# Altium schematic sheet 04_Codec.SchDoc
size 513 x 386 mm
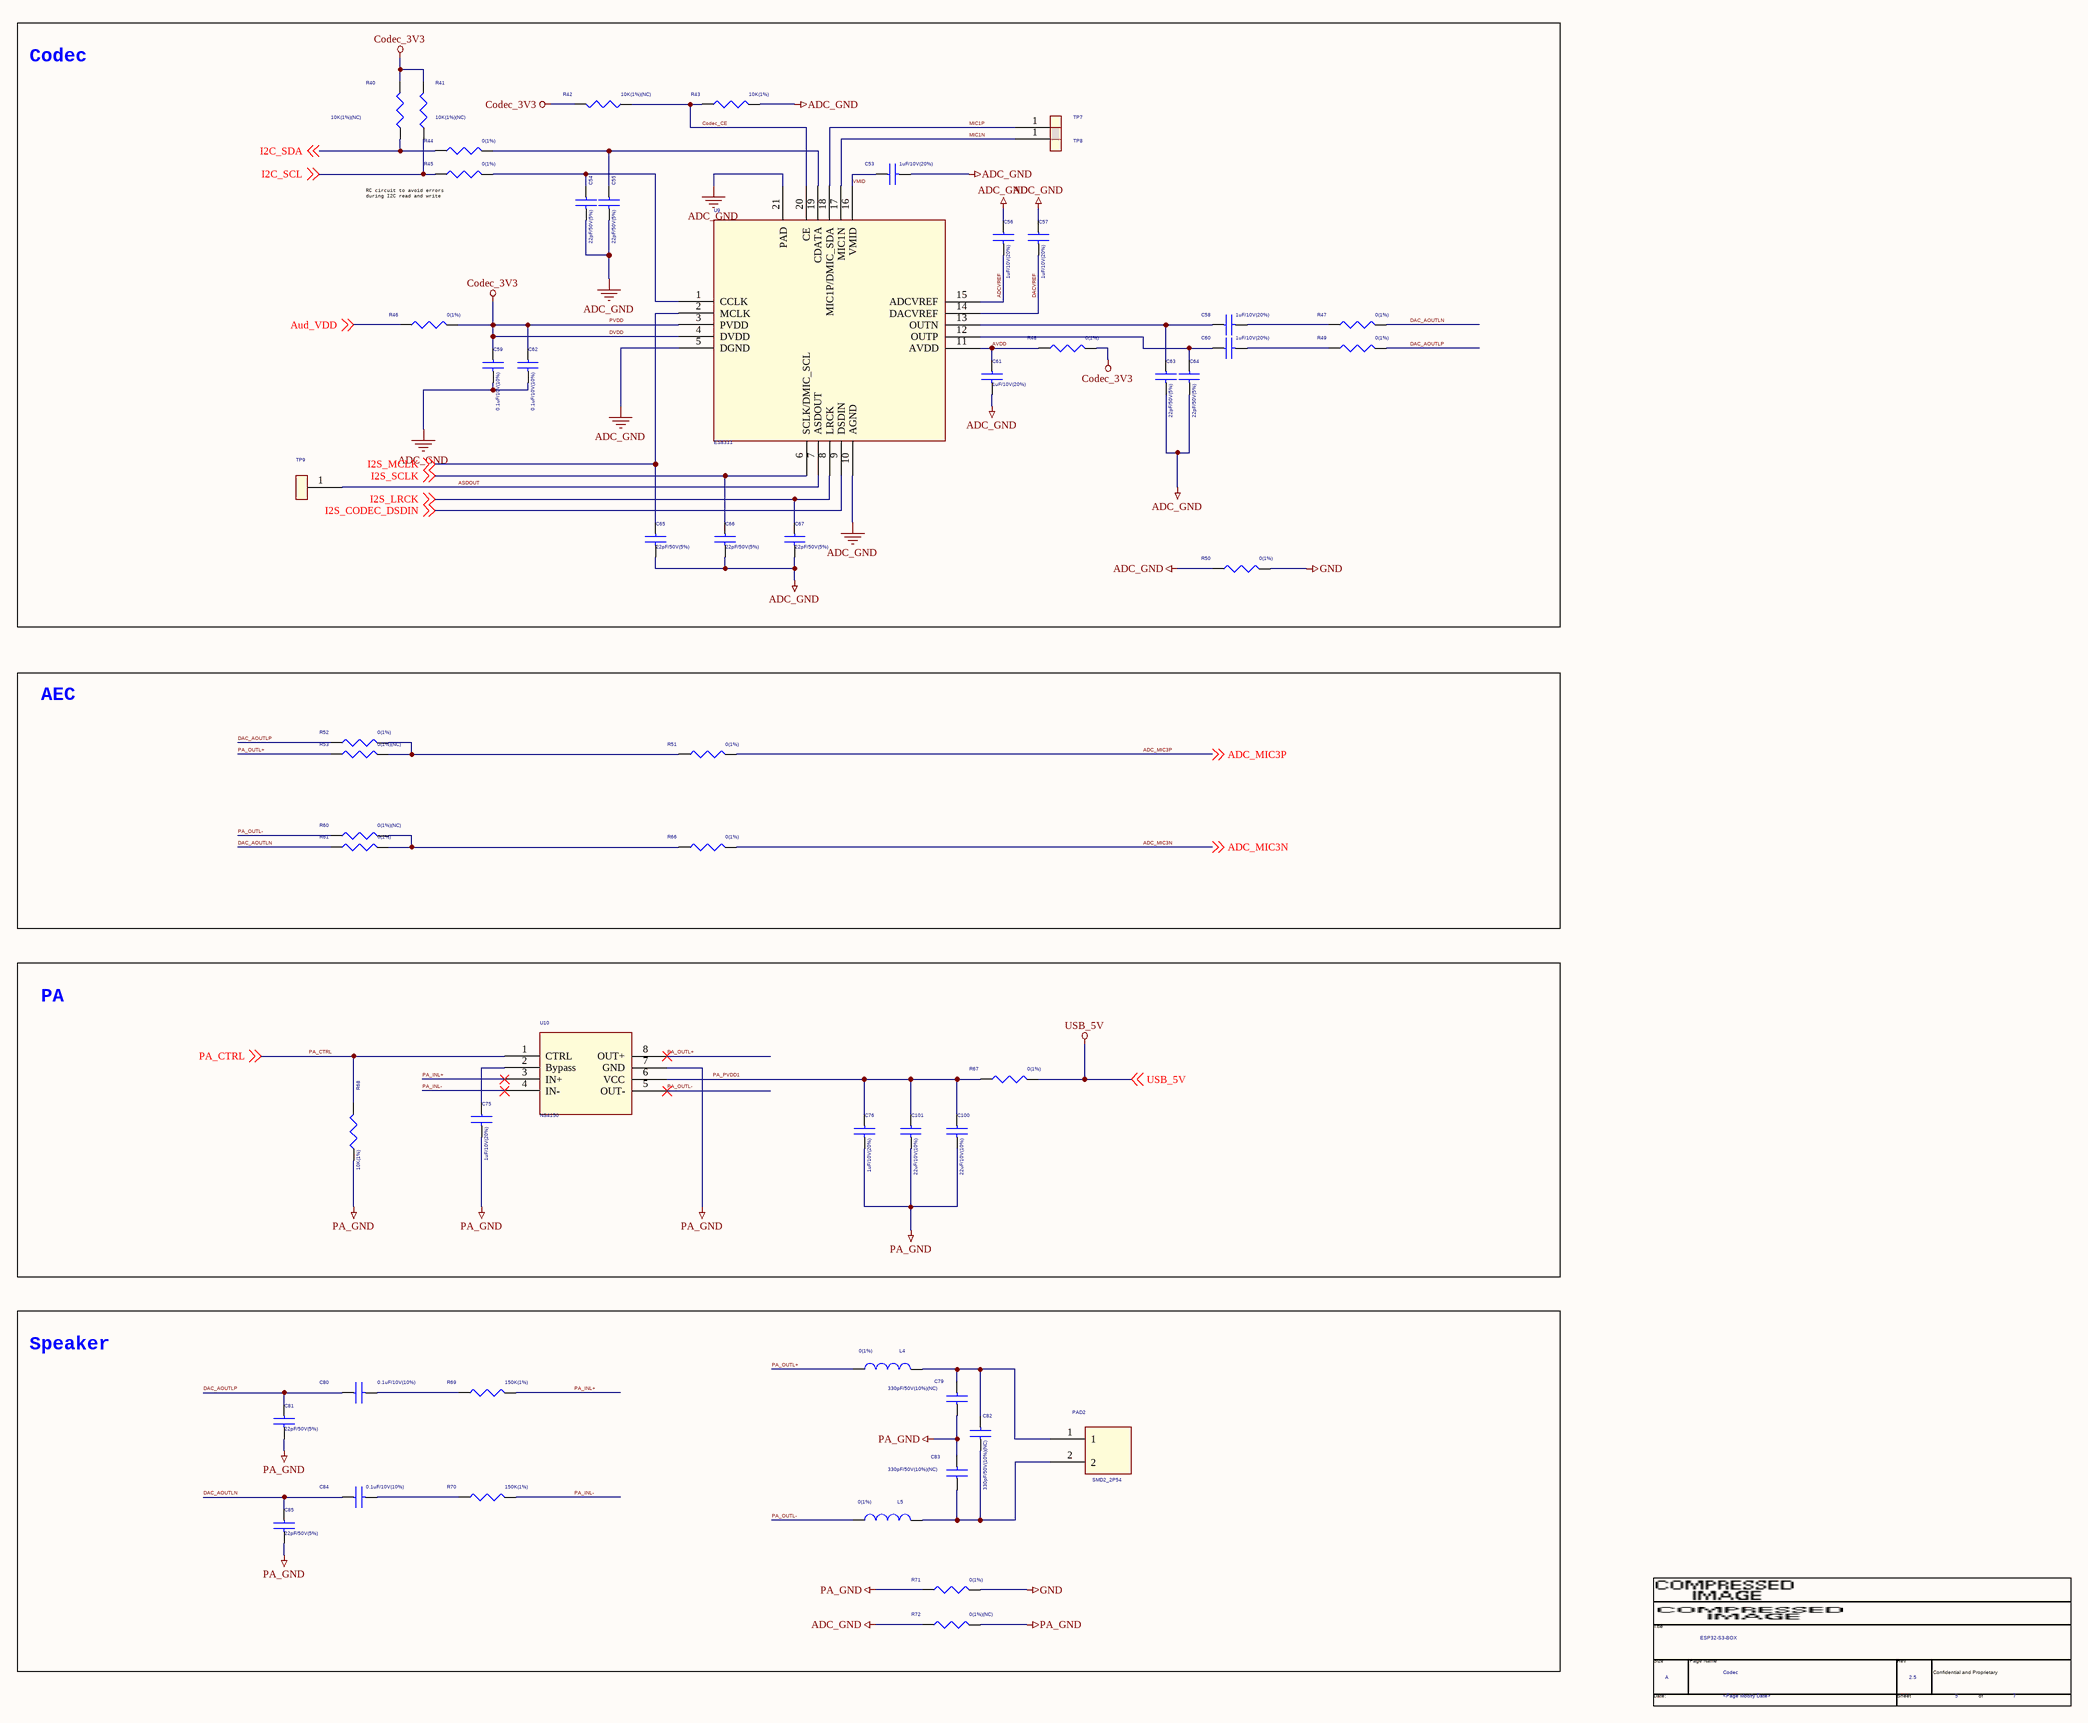
[diagram p0: 04_Codec.SchDoc]

## Parts
*  Page Modify Date: <Page Modify Date>  Page Name: Codec  Title: ESP32-S3-BOX  Page Size: A  Page Number: 5  Page Count: 7  RevCode: 2.5  (hidden comment: espTitleBlock3)  (graphical)
C53  1uF/10V(20%)  [0201_C]
C54  22pF/50V(5%)  [0201_C]
C55  22pF/50V(5%)  [0201_C]
C56  1uF/10V(20%)  [0201_C]
C57  1uF/10V(20%)  [0201_C]
C58  1uF/10V(20%)  [0201_C]
C59  0.1uF/10V(10%)  [0201_C]
C60  1uF/10V(20%)  [0201_C]
C61  1uF/10V(20%)  [0201_C]
C62  0.1uF/10V(10%)  [0201_C]
C63  22pF/50V(5%)  [0201_C]
C64  22pF/50V(5%)  [0201_C]
C65  22pF/50V(5%)  [0201_C]
C66  22pF/50V(5%)  [0201_C]
C67  22pF/50V(5%)  [0201_C]
C75  1uF/10V(20%)  [0201_C]
C76  1uF/10V(20%)  [0201_C]
C79  330pF/50V(10%)(NC)  [0201_C]
C80  0.1uF/10V(10%)  [0201_C]
C81  22pF/50V(5%)  [0201_C]
C82  330pF/50V(10%)(NC)  [0201_C]
C83  330pF/50V(10%)(NC)  [0201_C]
C84  0.1uF/10V(10%)  [0201_C]
C85  22pF/50V(5%)  [0201_C]
C100  22uF/10V(10%)  [0805_C]
C101  22uF/10V(10%)  [0805_C]
L4  0(1%)  [0603_R]
L5  0(1%)  [0603_R]
PAD2  SMD2_2P54  [2pin]
R40  10K(1%)(NC)  [0201_R]
R41  10K(1%)(NC)  [0201_R]
R42  10K(1%)(NC)  [0201_R]
R43  10K(1%)  [0201_R]
R44  0(1%)  [0201_R]
R45  0(1%)  [0201_R]
R46  0(1%)  [0402_R]
R47  0(1%)  [0201_R]
R48  0(1%)  [0402_R]
R49  0(1%)  [0201_R]
R50  0(1%)  [0402_R]
R51  0(1%)  [0201_R]
R52  0(1%)  [0201_R]
R53  0(1%)(NC)  [0201_R]
R60  0(1%)(NC)  [0201_R]
R61  0(1%)  [0201_R]
R66  0(1%)  [0201_R]
R67  0(1%)  [0402_R]
R68  10K(1%)  [0201_R]
R69  150K(1%)  [0402_R]
R70  150K(1%)  [0402_R]
R71  0(1%)  [0402_R]
R72  0(1%)(NC)  [0402_R]
TP7  TESTPOINT  [TPC_D40]  (value not drawn)
TP8  TESTPOINT  [TPC_D40]  (value not drawn)
TP9  TESTPOINT  [TPC_D40]  (value not drawn)
U9  ES8311  [QFN-20_4X4]
U10  NS4150  [MSOP-8]

## Blocks framed on the sheet
Codec: C53-C67 R40-R50 TP7-TP9 U9
AEC: R51-R53 R60 R61 R66
PA: C75 C76 C100 C101 R67 R68 U10
Speaker: C79-C85 L4 L5 PAD2 R69-R72

## Nets
ADC_GND: C53.2 C54.2 C55.2 C56.1 C57.1 C59.2 C61.2 C62.2 C63.2 C64.2 C65.2 C66.2 C67.2 R43.2 R50.1 R72.1 U9.5(DGND) U9.10(AGND) U9.21(PAD)
DVDD: C59.1 C62.1 R40.2 R41.2 R42.2 R46.2 R48.2 U9.3(PVDD) U9.4(DVDD)  [also labelled Codec_3V3, PVDD]
GND: R50.2 R71.2
PA_GND: C75.2 C76.2 C79.1 C81.2 C83.2 C85.2 C100.2 C101.2 R68.1 R71.1 R72.2 U10.7(GND)
USB_5V: R67.2 ; off-sheet USB_5V
ADC_MIC3N: R66.2 ; off-sheet ADC_MIC3N
ADC_MIC3P: R51.2 ; off-sheet ADC_MIC3P
ADCVREF: C56.2 U9.15(ADCVREF)
ASDOUT: TP9.1 U9.7(ASDOUT)
Aud_VDD: R46.1 ; off-sheet Aud_VDD
AVDD: C61.1 R48.1 U9.11(AVDD)
Codec_CE: R42.1 R43.1 U9.20(CE)
DAC_AOUTLN: C84.1 C85.1 R47.2 R61.1
DAC_AOUTLP: C80.1 C81.1 R49.2 R52.1
DACVREF: C57.2 U9.14(DACVREF)
I2C_SCL: R41.1 R45.1 ; off-sheet I2C_SCL
I2C_SDA: R40.1 R44.1 ; off-sheet I2C_SDA
I2S_CODEC_DSDIN: U9.9(DSDIN) ; off-sheet I2S_CODEC_DSDIN
I2S_LRCK: C67.1 U9.8(LRCK) ; off-sheet I2S_LRCK
I2S_MCLK: C65.1 U9.2(MCLK) ; off-sheet I2S_MCLK
I2S_SCLK: C66.1 U9.6(SCLK/DMIC_SCL) ; off-sheet I2S_SCLK
MIC1N: TP8.1 U9.17(MIC1N)
MIC1P: TP7.1 U9.18(MIC1P/DMIC_SDA)
PA_CTRL: R68.2 U10.1(CTRL) ; off-sheet PA_CTRL
PA_INL+: R69.2 U10.3(IN+)
PA_INL-: R70.2 U10.4(IN-)
PA_OUTL+: L4.2 R53.1 U10.8(OUT+)
PA_OUTL-: L5.2 R60.1 U10.5(OUT-)
PA_PVDD1: C76.1 C100.1 C101.1 R67.1 U10.6(VCC)
VMID: C53.1 U9.16(VMID)
NetC54_1: C54.1 R45.2 U9.1(CCLK)
NetC55_1: C55.1 R44.2 U9.19(CDATA)
NetC58_1: C58.1 C63.1 U9.13(OUTN)
NetC58_2: C58.2 R47.1
NetC60_1: C60.1 C64.1 U9.12(OUTP)
NetC60_2: C60.2 R49.1
NetC75_1: C75.1 U10.2(Bypass)
NetC79_2: C79.2 C82.2 L4.1 PAD2.1
NetC80_2: C80.2 R69.1
NetC82_1: C82.1 C83.1 L5.1 PAD2.2
NetC84_2: C84.2 R70.1
NetR51_1: R51.1 R52.2 R53.2
NetR60_2: R60.2 R61.2 R66.1

## Notes on the sheet
- (near R45) RC circuit to avoid errors
  during I2C read and write
- (in symbol espTitleBlock3) Title; Size; Page Name; Rev; Confidential and Proprietary; Date:; Sheet; of

## Library data of the parts
* = espTitleBlock3: Doc: ESP32-S3-EYE_V1.0; OrgName: ESPRESSIF
C53 C56-C58 C60 C61 C75 C76 = CAPACITOR: Part Number: ES11026103700001; CODE12: ES11.02.610.3.7.0.00; Part Type: Capacitor
C54 C55 C63-C67 C81 C85 = CAPACITOR: Part Number: ES11021226520000; CODE12: ES11.02.122.6.5.2.00; Part Type: Capacitor
C59 C62 C80 C84 = CAPACITOR: Part Number: ES11025103610001; CODE12: ES11.02.510.3.6.1.00; Part Type: Capacitor
C79 C82 C83 = CAP NP
C100 C101 = CAPACITOR: Part Number: ES11087223720000; CODE12: ES11.08.722.3.7.2.00; Part Type: Capacitor
L4 L5 = INDUCTOR
R40-R43 R68 = RESISTOR: Part Number: ES21024100000001; CODE12: ES21.02.4100.0.00.0; Part Type: Resistor
R44 R45 R47 R49 R51-R53 R60 R61 R66 = RESISTOR: Part Number: ES21020000000001; CODE12: ES21.02.0000.0.00.0; Part Type: Resistor
R46 R48 R50 R67 R71 R72 = RESISTOR: Part Number: ES21040000000001; CODE12: ES21.04.0000.0.00.0; Part Type: Resistor
R69 R70 = RESISTOR: Part Number: ES21045150000001; CODE12: ES21.04.5150.0.00.0; Part Type: Resistor
TP7-TP9 = TESTPOINT: Part Number: ES51990010000000; CODE12: ES51.99.0010.00.00; Part Type: -
U9 = ES8311: Part Number: ES41181204000000; CODE12: ES41.18.12.04.00.00; Part Type: Audio ICs
U10 = NS4150: Part Number: ES41180401000000; CODE12: ES41.18.04.01.00.00; Part Type: Audio ICs